# Altium schematic sheet W7500S2E-X1.SchDoc
size 381 x 241 mm
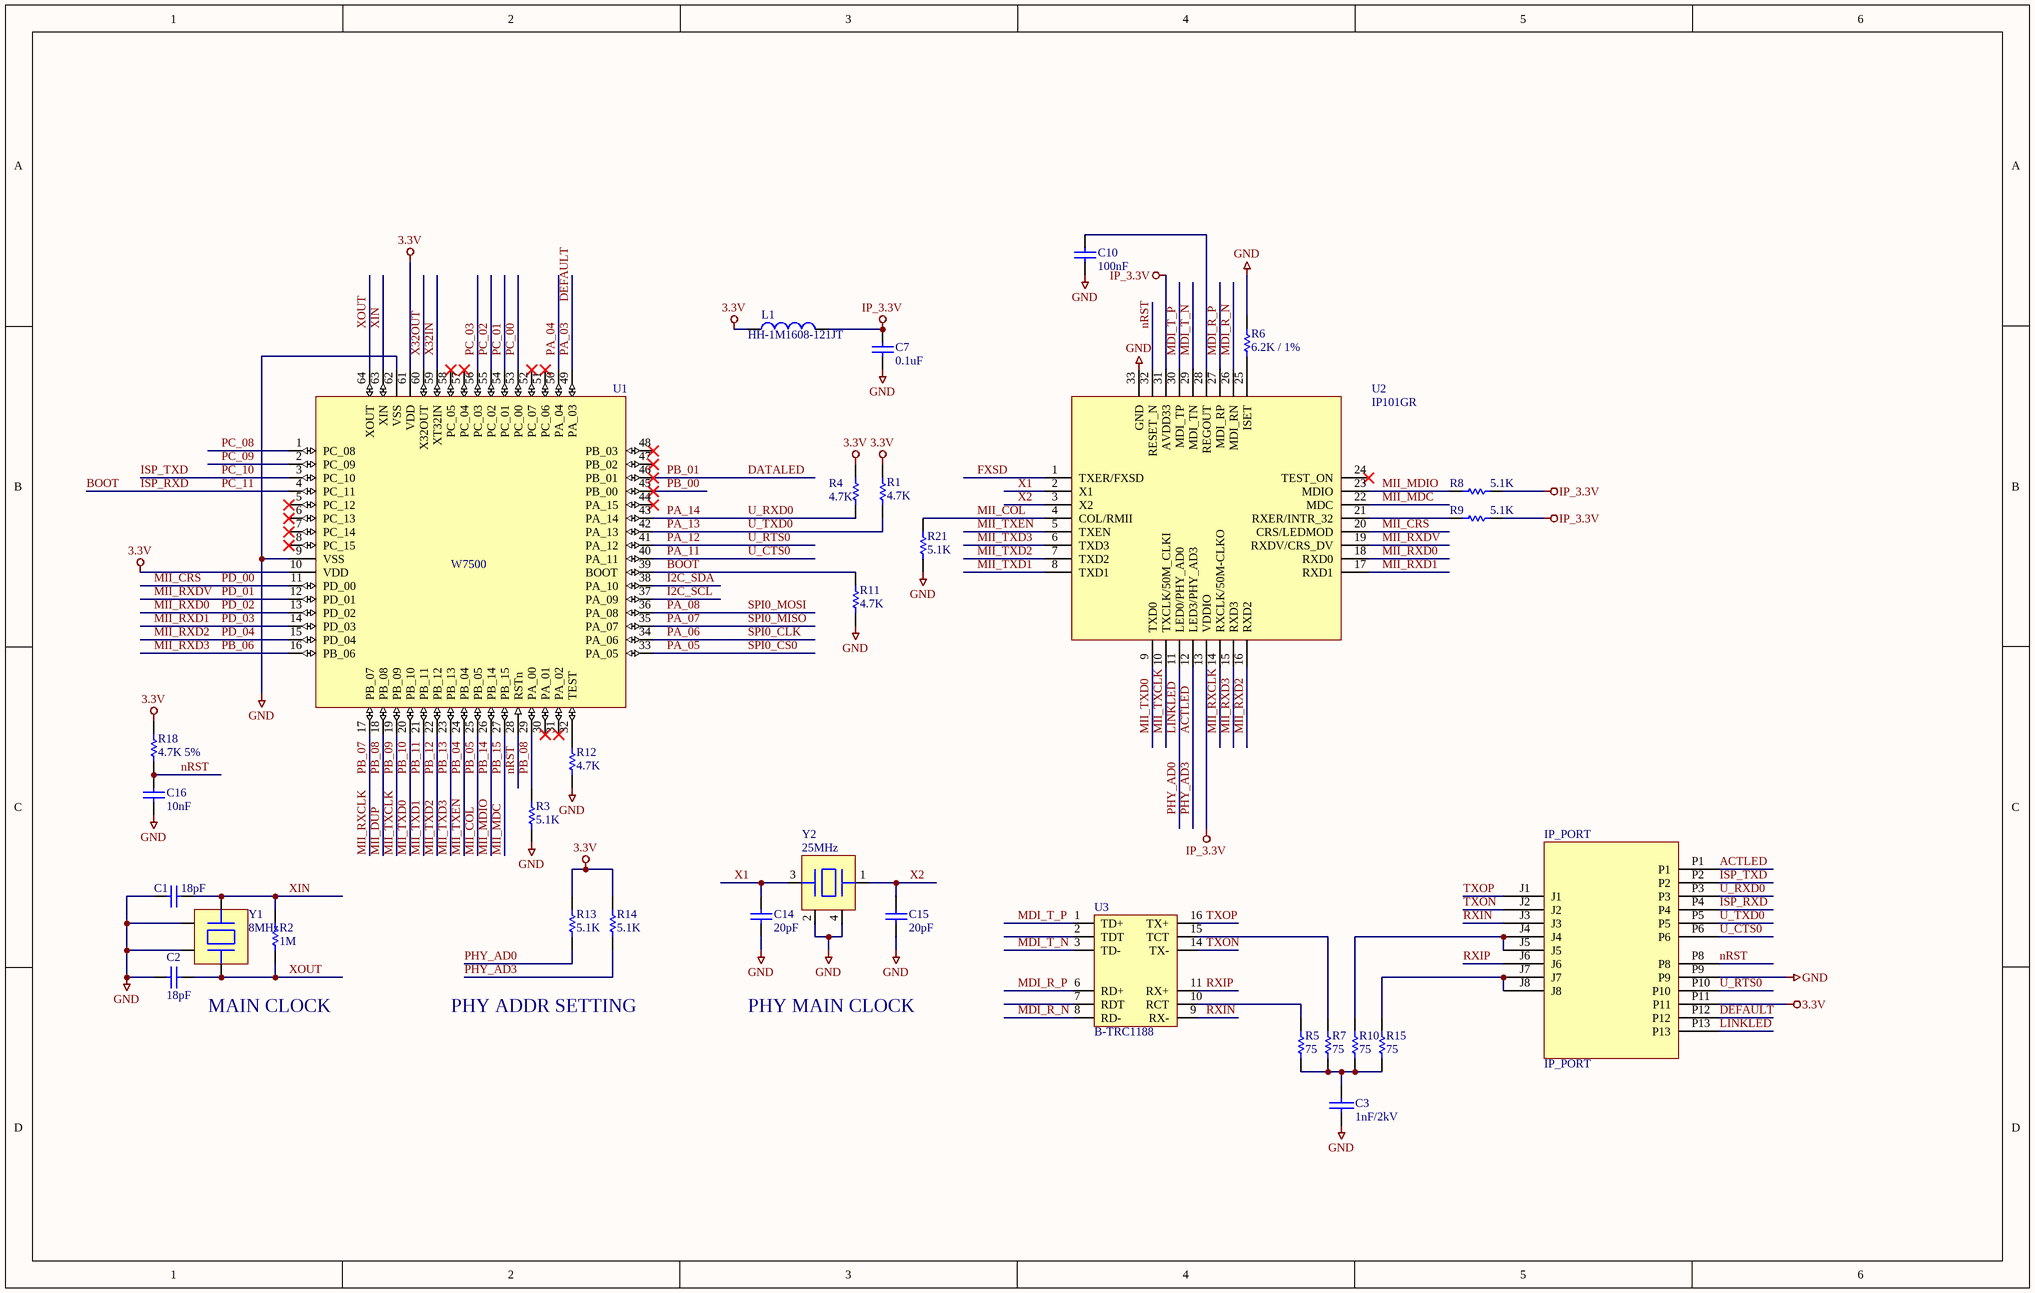
[diagram p0: W7500S2E-X1.SchDoc]

## Parts
C1  18pF  [CAP-0402]
C2  18pF  [CAP-0402]
C3  1nF/2kV  [1206-C - SMD]
C7  0.1uF  [CAP-0402]
C10  100nF  [CAP-0402]
C14  20pF  [CAP-0402]
C15  20pF  [CAP-0402]
C16  10nF  [CAP-0402]
IP_PORT  IP_PORT  [IP_PORT]
L1  HH-1M1608-121JT  [IND-0603]
R1  4.7K  [RES-0402]
R2  1M  [RES-0402]
R3  5.1K  [RES-0402]
R4  4.7K  [RES-0402]
R5  75  [RES-0402]
R6  6.2K / 1%  [RES-0402]
R7  75  [RES-0402]
R8  5.1K  [RES-0402]
R9  5.1K  [RES-0402]
R10  75  [RES-0402]
R11  4.7K  [RES-0402]
R12  4.7K  [RES-0402]
R13  5.1K  [RES-0402]
R14  5.1K  [RES-0402]
R15  75  [RES-0402]
R18  value 4.7K 5%  [RES-0402]  (hidden comment: Res1)
R21  5.1K  [RES-0402]
U1  W7500  [W7500-LQFP64]
U2  IP101GR  [QFN32(4X4mm)]
U3  B-TRC1188  [11FB-05NL]
Y1  8MHz  [OSC-TZ1067B]
Y2  25MHz  [OSC-TZ1067B]

## Nets
3.3V: IP_PORT.P11 L1.1 R1.1 R4.1 R13.2 R14.2 R18.2 U1.10(VDD) U1.61(VDD)
GND: C1.1 C2.1 C3.1 C7.1 C10.1 C14.1 C15.1 C16.1 IP_PORT.P9 R3.1 R6.2 R11.1 R12.1 R21.1 U1.9(VSS) U1.62(VSS) U2.33(GND) Y1.2 Y1.4 Y2.2 Y2.4
IP_3.3V: C7.2 L1.2 R8.1 R9.1 U2.13(VDDIO) U2.31(AVDD33)
ACTLED: IP_PORT.P1 R14.1 U2.12(LED3/PHY_AD3)  [also labelled PHY_AD3]
BOOT: IP_PORT.P4 R11.2 U1.4(PC_11) U1.39(BOOT)  [also labelled ISP_RXD, PC_11]
DATALED: U1.46(PB_01)  [also labelled PB_01]
DEFAULT: IP_PORT.P12 U1.49(PA_03)  [also labelled PA_03]
FXSD: U2.1(TXER/FXSD)
I2C_SCL: U1.37(PA_09)
I2C_SDA: U1.38(PA_10)
ISP_TXD: IP_PORT.P2 U1.3(PC_10)  [also labelled PC_10]
LINKLED: IP_PORT.P13 R13.1 U2.11(LED0/PHY_AD0)  [also labelled PHY_AD0]
MDI_R_N: U2.26(MDI_RN) U3.8(RD-)
MDI_R_P: U2.27(MDI_RP) U3.6(RD+)
MDI_T_N: U2.29(MDI_TN) U3.3(TD-)
MDI_T_P: U2.30(MDI_TP) U3.1(TD+)
MII_COL: R21.2 U1.25(PB_05) U2.4(COL/RMII)  [also labelled PB_05]
MII_CRS: U1.11(PD_00) U2.20(CRS/LEDMOD)  [also labelled PD_00]
MII_DUP: R3.2 U1.18(PB_08) U1.29(PA_00)  [also labelled PB_08]
MII_MDC: U1.27(PB_15) U2.22(MDC)  [also labelled PB_15]
MII_MDIO: R8.2 U1.26(PB_14) U2.23(MDIO)  [also labelled PB_14]
MII_RXCLK: U1.17(PB_07) U2.14(RXCLK/50M-CLKO)  [also labelled PB_07]
MII_RXD0: U1.13(PD_02) U2.18(RXD0)  [also labelled PD_02]
MII_RXD1: U1.14(PD_03) U2.17(RXD1)  [also labelled PD_03]
MII_RXD2: U1.15(PD_04) U2.16(RXD2)  [also labelled PD_04]
MII_RXD3: U1.16(PB_06) U2.15(RXD3)  [also labelled PB_06]
MII_RXDV: U1.12(PD_01) U2.19(RXDV/CRS_DV)  [also labelled PD_01]
MII_TXCLK: U1.19(PB_09) U2.10(TXCLK/50M_CLKI)  [also labelled PB_09]
MII_TXD0: U1.20(PB_10) U2.9(TXD0)  [also labelled PB_10]
MII_TXD1: U1.21(PB_11) U2.8(TXD1)  [also labelled PB_11]
MII_TXD2: U1.22(PB_12) U2.7(TXD2)  [also labelled PB_12]
MII_TXD3: U1.23(PB_13) U2.6(TXD3)  [also labelled PB_13]
MII_TXEN: U1.24(PB_04) U2.5(TXEN)  [also labelled PB_04]
nRST: C16.2 IP_PORT.P8 R18.1 U1.28(RSTn) U2.32(RESET_N)
PA_04: U1.50(PA_04)
PA_05: U1.33(PA_05)  [also labelled SPI0_CS0]
PA_06: U1.34(PA_06)  [also labelled SPI0_CLK]
PA_07: U1.35(PA_07)  [also labelled SPI0_MISO]
PA_08: U1.36(PA_08)  [also labelled SPI0_MOSI]
PA_11: IP_PORT.P6 U1.40(PA_11)  [also labelled U_CTS0]
PA_12: IP_PORT.P10 U1.41(PA_12)  [also labelled U_RTS0]
PA_13: IP_PORT.P5 R1.2 U1.42(PA_13)  [also labelled U_TXD0]
PA_14: IP_PORT.P3 R4.2 U1.43(PA_14)  [also labelled U_RXD0]
PB_00: U1.45(PB_00)
PC_00: U1.53(PC_00)
PC_01: U1.54(PC_01)
PC_02: U1.55(PC_02)
PC_03: U1.56(PC_03)
PC_08: U1.1(PC_08)
PC_09: U1.2(PC_09)
RXIN: IP_PORT.J3 U3.9(RX-)
RXIP: IP_PORT.J6 U3.11(RX+)
TXON: IP_PORT.J2 U3.14(TX-)
TXOP: IP_PORT.J1 U3.16(TX+)
X1: C14.2 U2.2(X1) Y2.3
X2: C15.2 U2.3(X2) Y2.1
X32IN: U1.59(XT32IN)
X32OUT: U1.60(X32OUT)
XIN: C1.2 R2.1 U1.63(XIN) Y1.3
XOUT: C2.2 R2.2 U1.64(XOUT) Y1.1
NetC3_2: C3.2 R5.2 R7.2 R10.2 R15.2
NetC10_2: C10.2 U2.28(REGOUT)
NetIP_PORT_J4: IP_PORT.J4 IP_PORT.J5 R10.1
NetIP_PORT_J7: IP_PORT.J7 IP_PORT.J8 R15.1
NetR5_1: R5.1 U3.10(RCT)
NetR6_1: R6.1 U2.25(ISET)
NetR7_1: R7.1 U3.15(TCT)
NetR9_2: R9.2 U2.21(RXER/INTR_32)
NetR12_2: R12.2 U1.32(TEST)

Not connected (* = marked no-connect by the designer): U1 5(PC_12)* 6(PC_13)* 7(PC_14)* 8(PC_15)* 30(PA_01)* 31(PA_02)* 44(PA_15)* 47(PB_02)* 48(PB_03)* 51(PC_06)* 52(PC_07)* 57(PC_04)* 58(PC_05)*; U2 24(TEST_ON)*; U3 2(TDT) 7(RDT)

## Notes on the sheet
- MAIN CLOCK
- PHY ADDR SETTING
- PHY MAIN CLOCK

## Library data of the parts
C1 C2 C7 C10 C14-C16 = CAP-0603: CAP-0402
C3 = CAP: Capacitor
L1 = IND-0603: Inductor 0603(1608)
R1-R15 R21 = RES-0603: RES-0402
R18 = Res1: Resistor; Published: 8-Jun-2000; LatestRevisionDate: 17-Jul-2002; LatestRevisionNote: Re-released for DXP Platform.; Publisher: Altium Limited
U1 = W7500: WIZnet ARM Cortex-M0
U3 = 11FB-05NL
Y1 Y2 = 82J0626-25MHz: X-tal 25MHz,3.2x2.5 SMD, CL=18pF